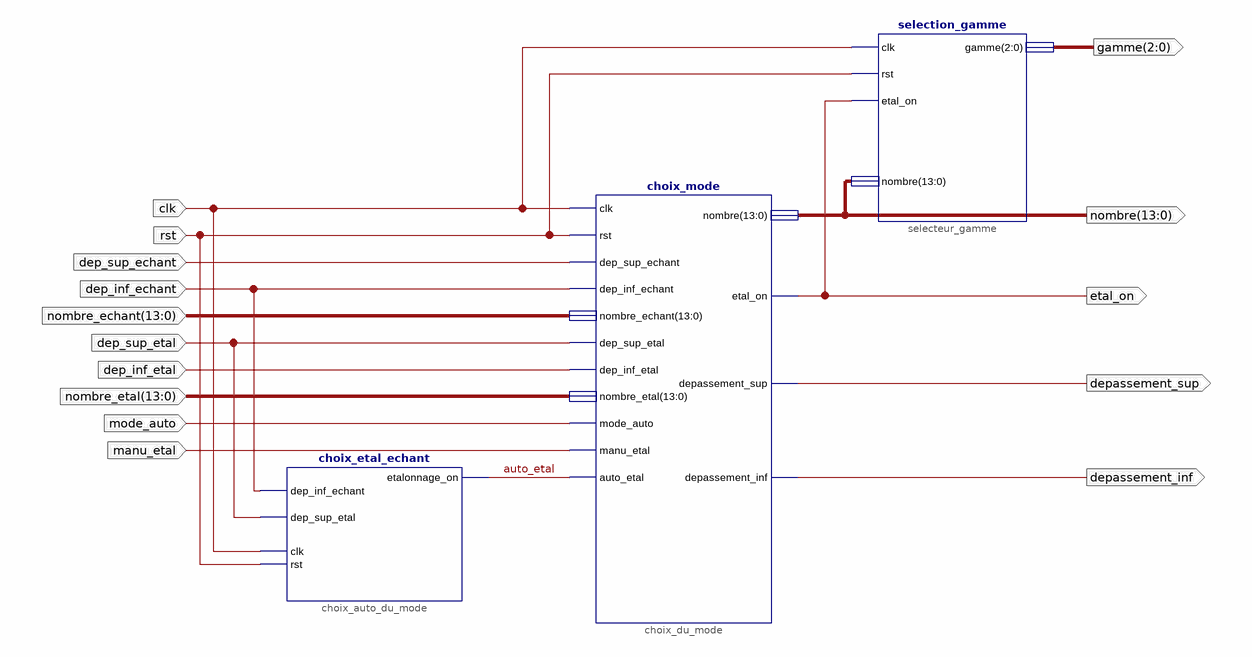
[diagram p0: schematic sheet 1]
// Xilinx ISE schematic selection_mode.sch (spartan3e) as structural Verilog: 3 symbols, 15 ports
module selection_mode (
  input  clk,
  input  rst,
  input  dep_sup_echant,
  input  dep_inf_echant,
  input  [13:0] nombre_echant,
  input  dep_sup_etal,
  input  dep_inf_etal,
  input  [13:0] nombre_etal,
  input  mode_auto,
  input  manu_etal,
  output depassement_inf,
  output depassement_sup,
  output etal_on,
  output [13:0] nombre,
  output [2:0] gamme
);

  wire auto_etal;

  choix_mode choix_du_mode (
    .clk(clk), .rst(rst), .mode_auto(mode_auto), .auto_etal(auto_etal), .manu_etal(manu_etal),
    .dep_sup_echant(dep_sup_echant), .dep_inf_echant(dep_inf_echant), .dep_sup_etal(dep_sup_etal),
    .dep_inf_etal(dep_inf_etal), .nombre_echant(nombre_echant), .nombre_etal(nombre_etal),
    .depassement_sup(depassement_sup), .depassement_inf(depassement_inf), .etal_on(etal_on), .nombre(nombre));
  choix_etal_echant choix_auto_du_mode (
    .clk(clk), .rst(rst), .dep_inf_echant(dep_inf_echant), .dep_sup_etal(dep_sup_etal),
    .etalonnage_on(auto_etal));
  selection_gamme selecteur_gamme (.clk(clk), .rst(rst), .etal_on(etal_on), .nombre(nombre), .gamme(gamme));
endmodule
